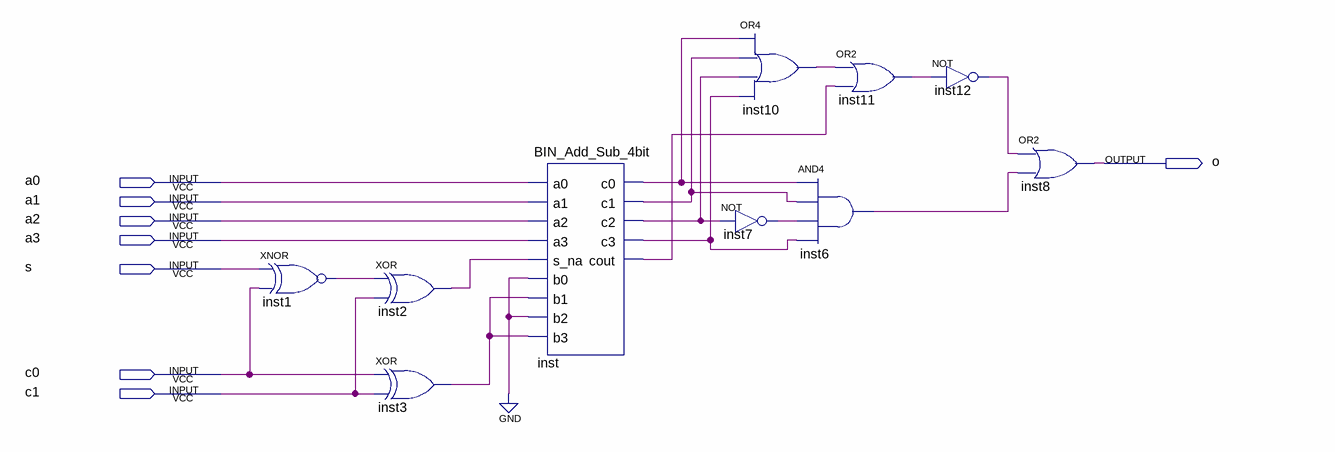
[diagram p0: schematic sheet]
// Quartus schematic ISDIV11.bdf as structural Verilog: 10 symbols, 8 pins
module ISDIV11 (
  input  a0,
  input  a1,
  input  a2,
  input  a3,
  input  s,
  input  c0,
  input  c1,
  output o
);

  wire inst1_out, inst2_out, inst3_out, inst6_out, inst7_out, inst10_out, inst11_out, inst12_out, inst_c0,
       inst_c1, inst_c2, inst_c3, inst_cout;

  xnor inst1 (inst1_out, s, c0);
  xor inst2 (inst2_out, inst1_out, c1);
  xor inst3 (inst3_out, c0, c1);
  BIN_Add_Sub_4bit inst (
    .a0(a0), .a1(a1), .a2(a2), .a3(a3), .s_na(inst2_out), .b0(1'b0), .b1(inst3_out), .b2(1'b0),
    .b3(inst3_out), .c0(inst_c0), .c1(inst_c1), .c2(inst_c2), .c3(inst_c3), .cout(inst_cout));
  or inst10 (inst10_out, inst_c0, inst_c1, inst_c2, inst_c3);
  not inst7 (inst7_out, inst_c2);
  and inst6 (inst6_out, inst_c0, inst_c1, inst7_out, inst_c3);
  or inst11 (inst11_out, inst10_out, inst_cout);
  not inst12 (inst12_out, inst11_out);
  or inst8 (o, inst12_out, inst6_out);
endmodule
